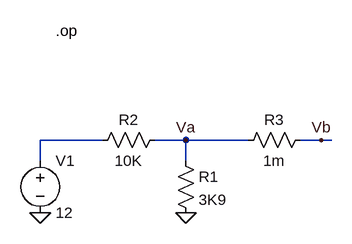
[diagram p0: schematic Draft1.asc]
Draft1.asc, the LTspice schematic file:
Version 4
SHEET 1 880 680
WIRE 16 64 -80 64
WIRE 144 64 96 64
WIRE 240 64 144 64
WIRE 352 64 320 64
WIRE 368 64 352 64
WIRE -80 96 -80 64
WIRE 144 96 144 64
FLAG -80 176 0
FLAG 144 176 0
FLAG 144 64 Va
FLAG 352 64 Vb
SYMBOL res 128 80 R0
SYMATTR InstName R1
SYMATTR Value 3K9
SYMBOL res 112 48 R90
WINDOW 0 0 56 VBottom 2
WINDOW 3 32 56 VTop 2
SYMATTR InstName R2
SYMATTR Value 10K
SYMBOL voltage -80 80 R0
WINDOW 123 0 0 Left 0
WINDOW 39 0 0 Left 0
SYMATTR InstName V1
SYMATTR Value 12
SYMBOL res 336 48 R90
WINDOW 0 0 56 VBottom 2
WINDOW 3 32 56 VTop 2
SYMATTR InstName R3
SYMATTR Value 1m
TEXT -56 -104 Left 2 !.op

The netlist it stands for:
* Draft1.asc
R1 Va 0 3K9
R2 Va N001 10K
V1 N001 0 12
R3 Vb Va 1m
.op
.backanno
.end